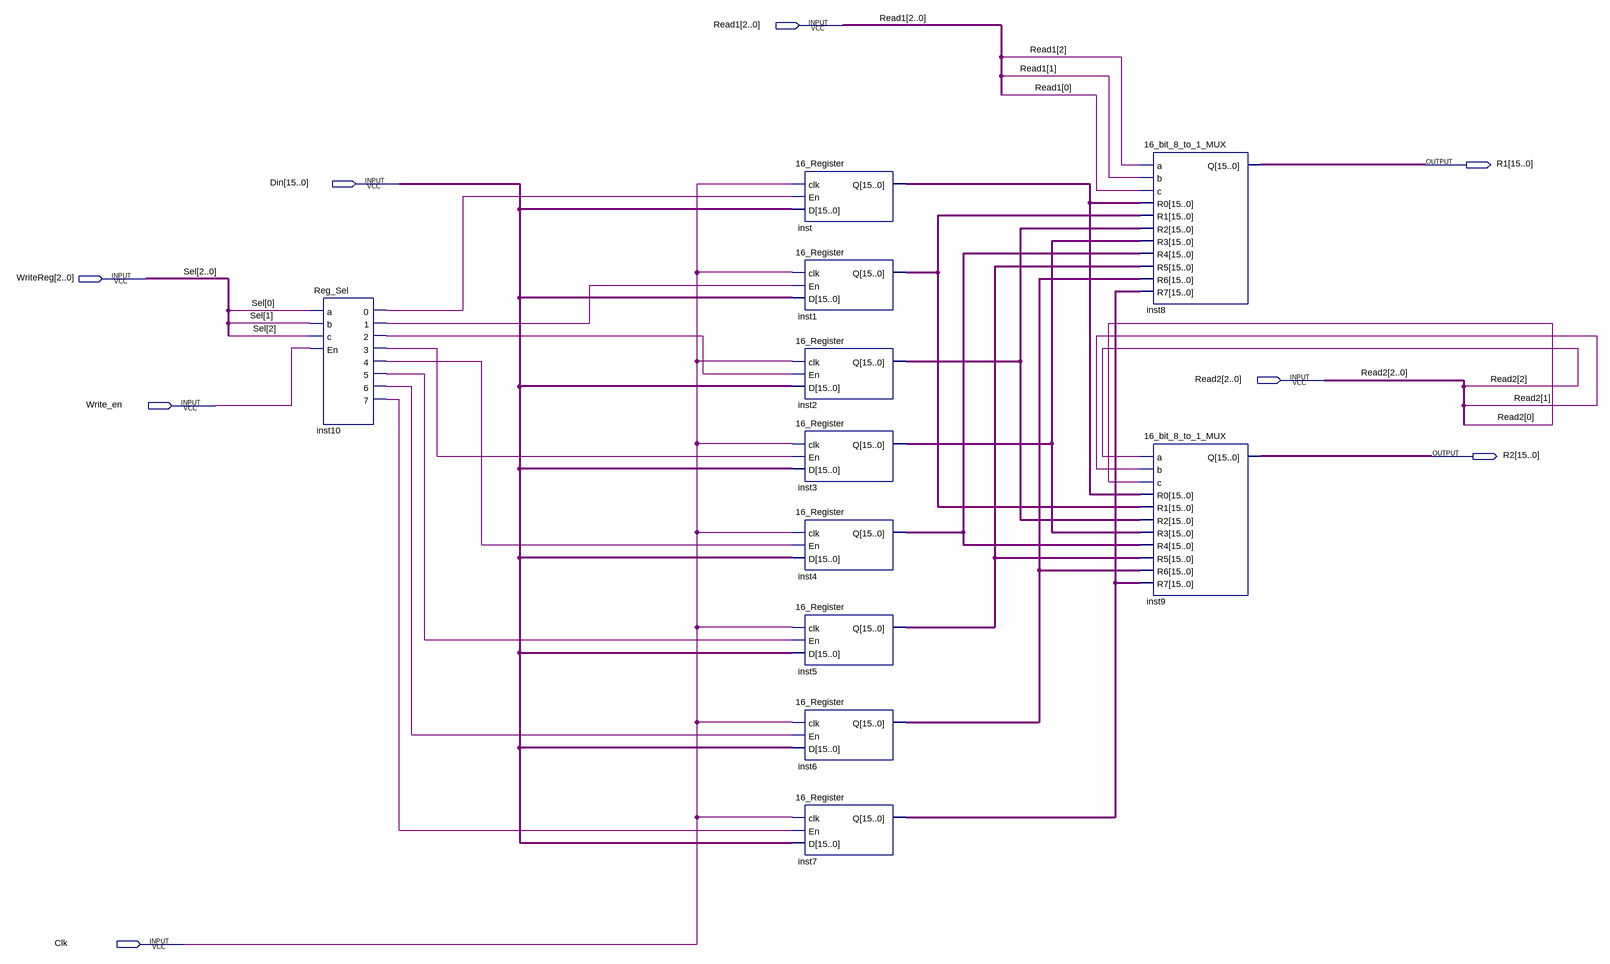
[diagram p0: schematic sheet]
// Quartus schematic Reg_File.bdf as structural Verilog: 11 symbols, 8 pins
module Reg_File (
  input  [2:0] Read1,
  input  [15:0] Din,
  input  [2:0] WriteReg,
  input  [2:0] Read2,
  input  Write_en,
  input  Clk,
  output [15:0] R1,
  output [15:0] R2
);

  wire inst10_0, inst10_1, inst10_2, inst10_3, inst10_4, inst10_5, inst10_6, inst10_7;
  wire [15:0] inst1_q, inst2_q, inst3_q, inst4_q, inst5_q, inst6_q, inst7_q, inst_q;

  Reg_Sel inst10 (
    .a(WriteReg[0]), .b(WriteReg[1]), .c(WriteReg[2]), .En(Write_en), .\0 (inst10_0), .\1 (inst10_1),
    .\2 (inst10_2), .\3 (inst10_3), .\4 (inst10_4), .\5 (inst10_5), .\6 (inst10_6), .\7 (inst10_7));
  \16_Register  inst (.clk(Clk), .En(inst10_0), .D(Din), .Q(inst_q));
  \16_Register  inst1 (.clk(Clk), .En(inst10_1), .D(Din), .Q(inst1_q));
  \16_Register  inst2 (.clk(Clk), .En(inst10_2), .D(Din), .Q(inst2_q));
  \16_Register  inst3 (.clk(Clk), .En(inst10_3), .D(Din), .Q(inst3_q));
  \16_Register  inst4 (.clk(Clk), .En(inst10_4), .D(Din), .Q(inst4_q));
  \16_Register  inst5 (.clk(Clk), .En(inst10_5), .D(Din), .Q(inst5_q));
  \16_Register  inst6 (.clk(Clk), .En(inst10_6), .D(Din), .Q(inst6_q));
  \16_Register  inst7 (.clk(Clk), .En(inst10_7), .D(Din), .Q(inst7_q));
  \16_bit_8_to_1_MUX  inst8 (
    .a(Read1[2]), .b(Read1[1]), .c(Read1[0]), .R0(inst_q), .R1(inst1_q), .R2(inst2_q), .R3(inst3_q),
    .R4(inst4_q), .R5(inst5_q), .R6(inst6_q), .R7(inst7_q), .Q(R1));
  \16_bit_8_to_1_MUX  inst9 (
    .a(Read2[2]), .b(Read2[1]), .c(Read2[0]), .R0(inst_q), .R1(inst1_q), .R2(inst2_q), .R3(inst3_q),
    .R4(inst4_q), .R5(inst5_q), .R6(inst6_q), .R7(inst7_q), .Q(R2));

  // Other names for the same wires on the sheet: Sel[2:0] = WriteReg
endmodule
